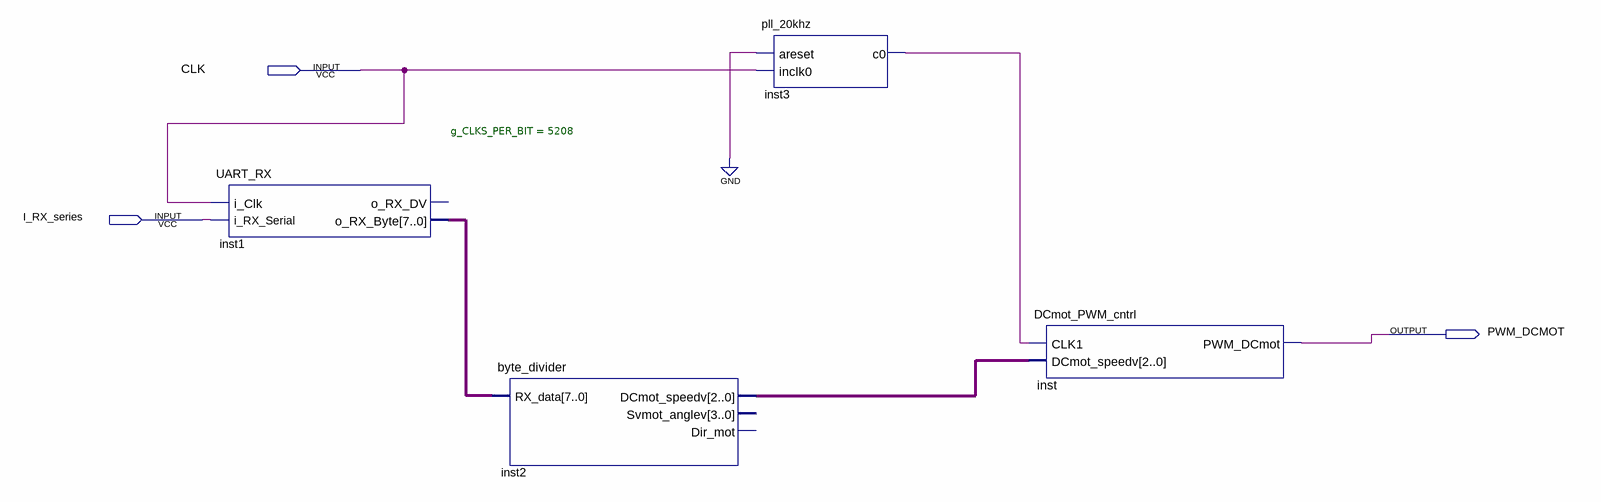
[diagram p0: schematic sheet]
// Quartus schematic main.bdf as structural Verilog: 4 symbols, 3 pins
module main (
  input  CLK,
  input  I_RX_series,
  output PWM_DCMOT
);

  wire inst3_c0;
  wire [2:0] inst2_dcmot_speedv;
  wire [7:0] inst1_o_rx_byte;

  UART_RX #(.g_CLKS_PER_BIT(5208)) inst1 (
    .i_Clk(CLK), .i_RX_Serial(I_RX_series), .o_RX_Byte(inst1_o_rx_byte));  // open: o_RX_DV
  byte_divider inst2 (.RX_data(inst1_o_rx_byte), .DCmot_speedv(inst2_dcmot_speedv));  // open: Svmot_anglev, Dir_mot
  pll_20khz inst3 (.areset(1'b0), .inclk0(CLK), .c0(inst3_c0));
  DCmot_PWM_cntrl inst (.CLK1(inst3_c0), .DCmot_speedv(inst2_dcmot_speedv), .PWM_DCmot(PWM_DCMOT));
endmodule
